# EAGLE design BAM_Reference_R2_1_1 (EAGLE 6.6.0)
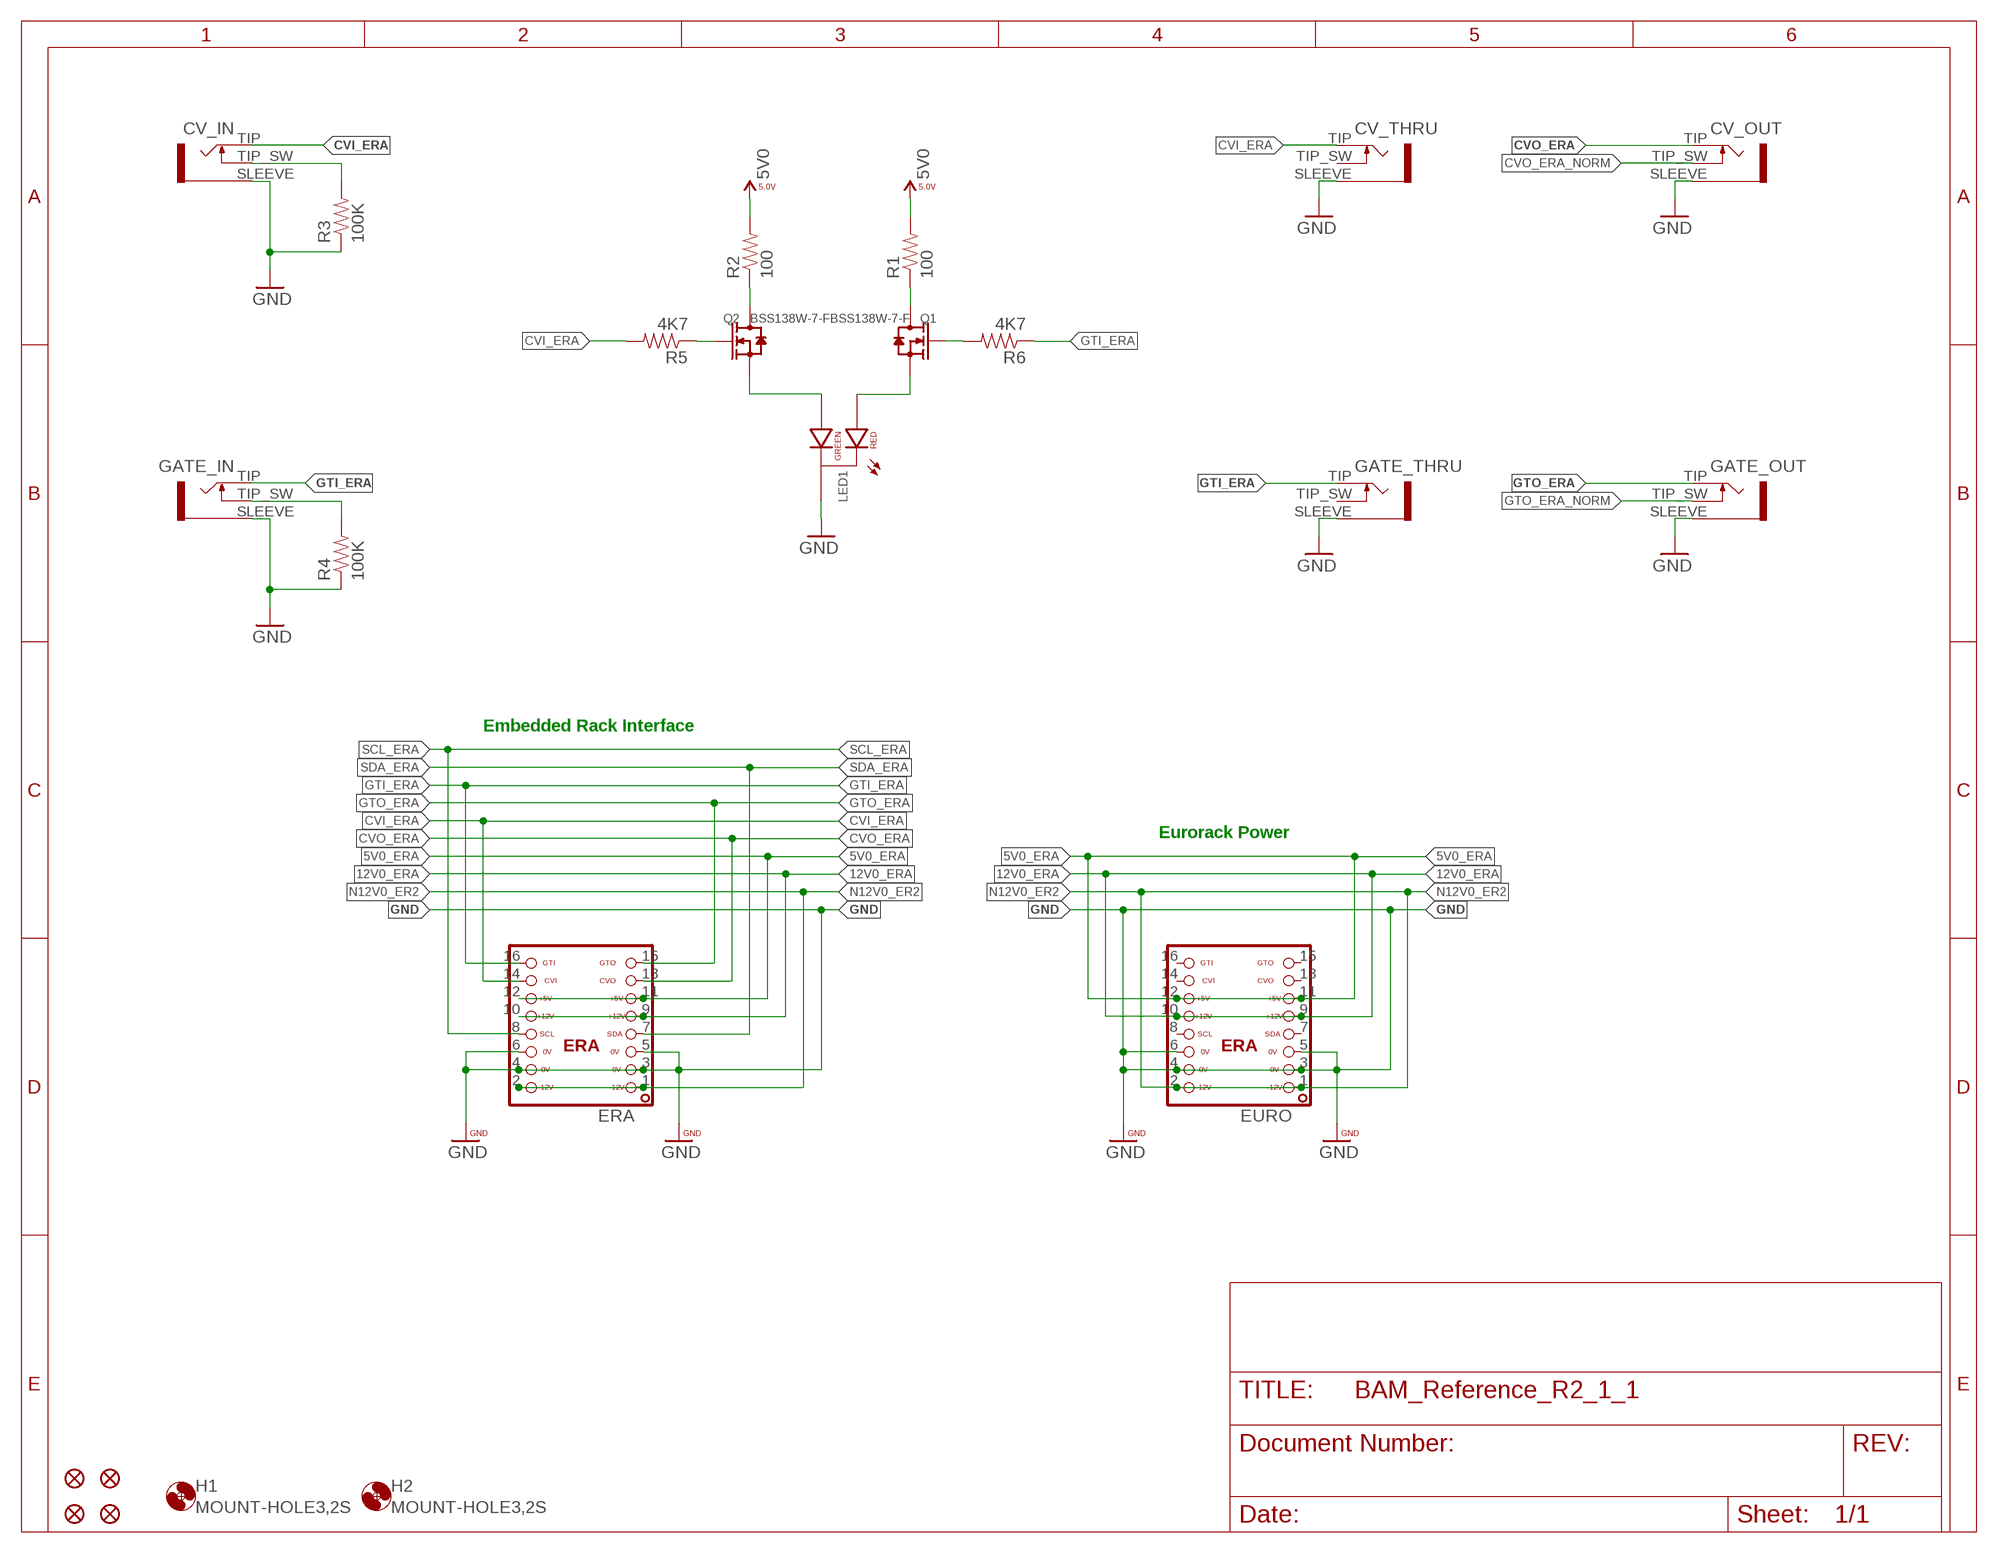
[diagram p0: schematic, sheet 1]

## Parts
CV_IN  JACK-3_5MM-MONO-SW-MJ_3502  [MJ-3502]
CV_OUT  JACK-3_5MM-MONO-SW-MJ_3502  [MJ-3502]
CV_THRU  JACK-3_5MM-MONO-SW-MJ_3502  [MJ-3502]
ERA  ERA-SHROUD  [ERA]
EURO  ERA-SHROUD  [ERA]
FID1  FIDUCIALUFIDUCIAL  [MICRO-FIDUCIAL]
FID2  FIDUCIALUFIDUCIAL  [MICRO-FIDUCIAL]
FID3  FIDUCIALUFIDUCIAL  [MICRO-FIDUCIAL]
FID4  FIDUCIALUFIDUCIAL  [MICRO-FIDUCIAL]
GATE_IN  JACK-3_5MM-MONO-SW-MJ_3502  [MJ-3502]
GATE_OUT  JACK-3_5MM-MONO-SW-MJ_3502  [MJ-3502]
GATE_THRU  JACK-3_5MM-MONO-SW-MJ_3502  [MJ-3502]
H1  MOUNT-HOLE3,2S  [3,2,SMALL]
H2  MOUNT-HOLE3,2S  [3,2,SMALL]
LED1  LED-RG-CC-PTH-G18500  [LED-RG-PANEL]
Q1  BSS138W-7-F  SMD-MOSFET-N-CH-50V-200MA-BSS138W-7-F(SOT-23)  [SOT-23]
Q2  BSS138W-7-F  SMD-MOSFET-N-CH-50V-200MA-BSS138W-7-F(SOT-23)  [SOT-23]
R1  100  RESISTOR0603  [0603-RES]
R2  100  RESISTOR0603  [0603-RES]
R3  100K  RESISTOR0603  [0603-RES]
R4  100K  RESISTOR0603  [0603-RES]
R5  4K7  RESISTOR0603  [0603-RES]
R6  4K7  RESISTOR0603  [0603-RES]

## Nets
5V0: R1.2 R2.2
5V0_ERA: ERA.11 ERA.12 EURO.11 EURO.12
12V0_ERA: ERA.9 ERA.10 EURO.9 EURO.10
CVI_ERA: CV_IN.TIP CV_THRU.TIP ERA.14 R5.2
CVO_ERA: CV_OUT.TIP ERA.13
CVO_ERA_NORM: CV_OUT.TIP_SW
GND: CV_IN.SLEEVE CV_OUT.SLEEVE CV_THRU.SLEEVE ERA.3 ERA.4 ERA.5 ERA.6 EURO.3 EURO.4 EURO.5 EURO.6 GATE_IN.SLEEVE GATE_OUT.SLEEVE GATE_THRU.SLEEVE LED1.CC(CATHODE) R3.1 R4.1
GTI_ERA: ERA.16 GATE_IN.TIP GATE_THRU.TIP R6.1
GTO_ERA: ERA.15 GATE_OUT.TIP
GTO_ERA_NORM: GATE_OUT.TIP_SW
N12V0_ER2: ERA.1 ERA.2 EURO.1 EURO.2
N$1: LED1.GREEN(GREEN_CATHODE) Q2.2(S)
N$2: LED1.RED(RED_CATHODE) Q1.2(S)
N$3: Q2.3(D) R2.1
N$4: Q1.3(D) R1.1
N$5: Q2.1(G) R5.1
N$6: Q1.1(G) R6.2
N$7: CV_IN.TIP_SW R3.2
N$8: GATE_IN.TIP_SW R4.2
SCL_ERA: ERA.8
SDA_ERA: ERA.7
Unconnected: CV_THRU.TIP_SW EURO.7 EURO.8 EURO.13 EURO.14 EURO.15 EURO.16 GATE_THRU.TIP_SW

## Notes on the sheet
- Embedded Rack Interface
- Eurorack Power

## Library data of the parts
CV_IN GATE_IN = oXo_Connectors:JACK-3_5MM-MONO-SW: Jack, 3.5mm, RIght Angle, Though-Hole
CV_OUT CV_THRU GATE_OUT GATE_THRU = halcyonmod_Connectors:JACK-3_5MM-MONO-SW: Jack, 3.5mm, RIght Angle, Though-Hole
ERA EURO = ERA:ERA: EuroRack2 - Backplane Connector
FID1-FID4 = TSOC-ESP8266-BASE:FIDUCIAL: Fiducial Alignment Points Various fiducial points for machine vision alignment.
H1 H2 = oXo_Hardware:MOUNT-HOLE: MOUNTING HOLE with drill center marker
LED1 = halcyonmod_Optoelectronics:LED-RG-CC-PTH: LED Red/Green Common Cathode Pin Through Hole
Q1 Q2 = Seeed-Transistor-2016:SMD-MOSFET-N-CH-50V-200MA-BSS138W-7-F(SOT-23): 305030000; MPN: BSS138W-7-F
R1-R6 = halcyonmod_Passives:RESISTOR: Resistor Basic schematic elements and footprints for 0603, 1206, and PTH resistors.

## Net classes
1 power: width 0.254 mm, drill 0.356 mm, clearance 0.178 mm

## Board
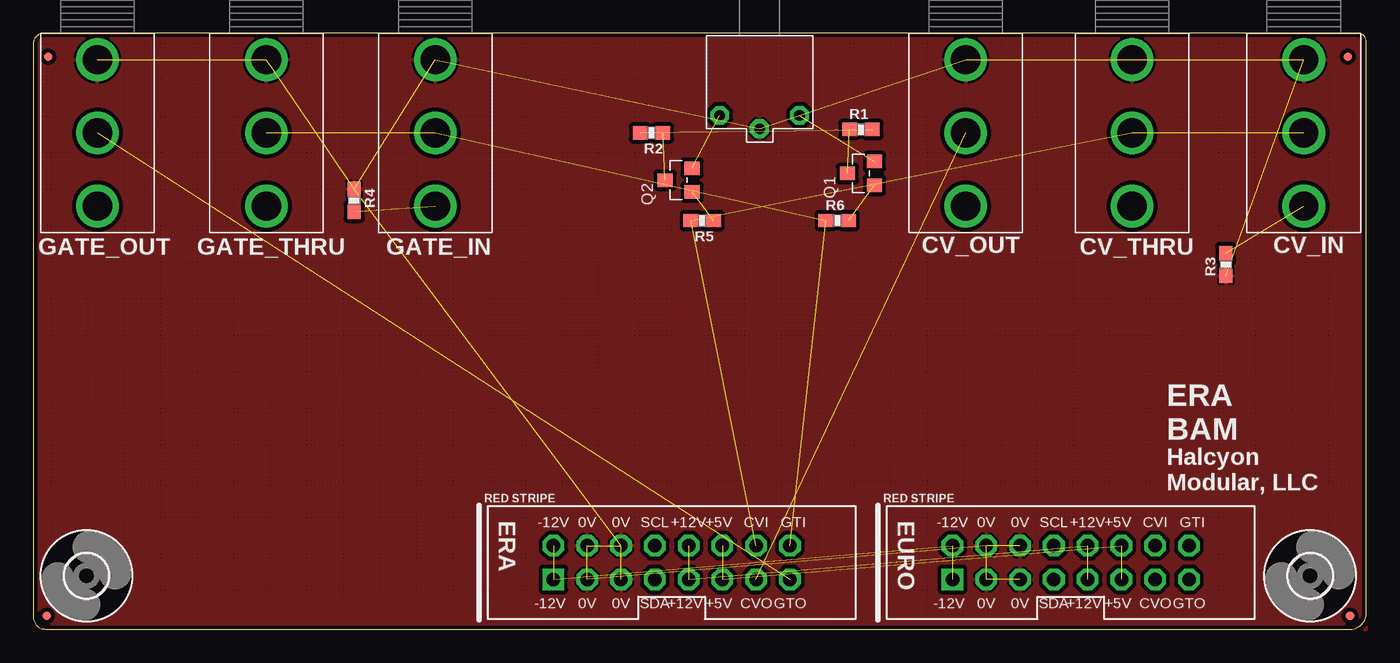
[diagram p1: board, top side]
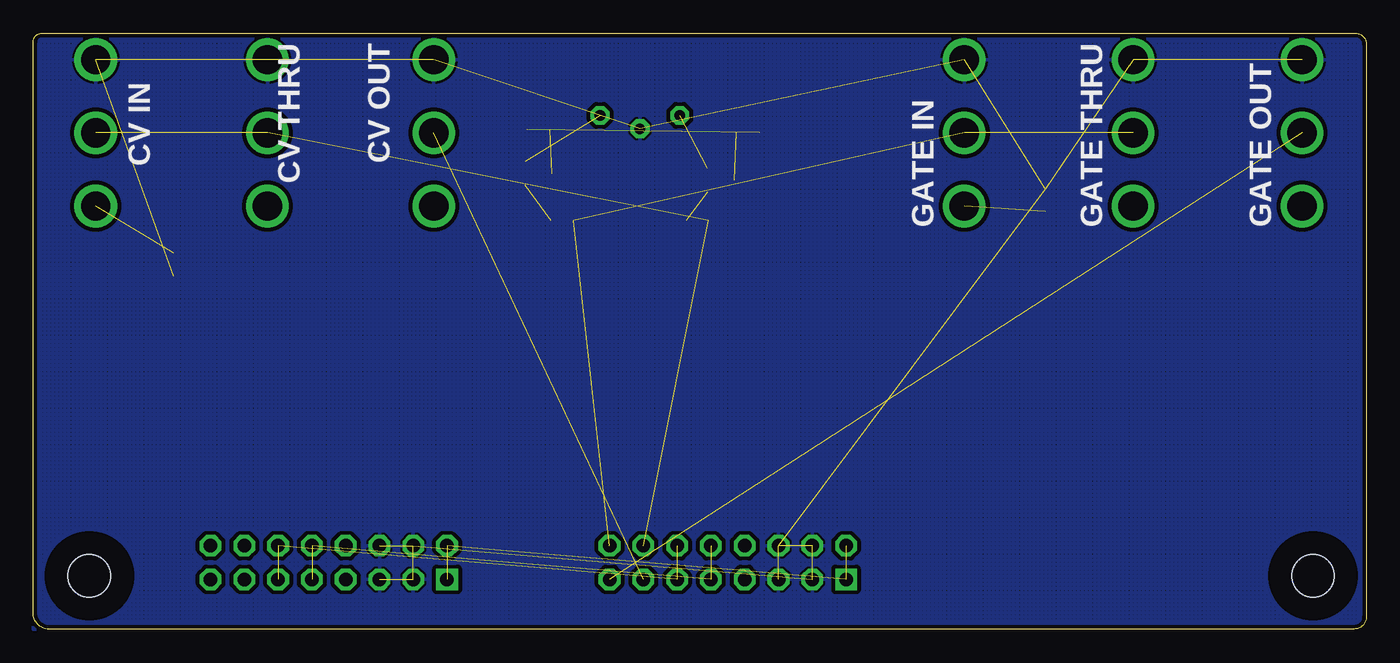
[diagram p2: board, bottom side, seen from below]

Size 100.22 x 44.84 mm. Coordinates in mm from the lower left corner, seen from the top.
Outline: 0.9,0.03 98.72,0.03 arc90 100.22,1.02 100.22,44.2 arc90 99.58,44.84 0.81,44.84 arc90 0,44.03 0,0.92 arc90 0.9,0.03
Copper layers (1*16): Top 0.035mm / dielectric 1.5mm / Bottom 0.035mm
Design rules "PatternAgents_7mil": minimum track width 7mil, minimum drill 14mil, track to track 7mil, track to pad 7mil, pad to pad 7mil, via to via 7mil, smd to smd 7mil, copper to edge 7mil, drill to drill 7mil, minimum pad ring 12mil, minimum via ring 10mil, stop-mask expansion 4mil, vias tented up to drill 25mil, thermal gap 7mil

### Footprints (pad centres in the part's own frame; a part is rotated, then mirrored left to right if it is on the bottom)
MJ-3502 = drill 2.2: SLEEVE -5.5,0; TIP 0,0; TIP_SW 5.5,0
ERA = drill 1.016 square: 1 -8.89,-1.27 | drill 1.016 octagon: 2 -8.89,1.27; 3 -6.35,-1.27; 4 -6.35,1.27; 5 -3.81,-1.27; 6 -3.81,1.27; 7 -1.27,-1.27; 8 -1.27,1.27; 9 1.27,-1.27; 10 1.27,1.27; 11 3.81,-1.27; 12 3.81,1.27; 13 6.35,-1.27; 14 6.35,1.27; 15 8.89,-1.27; 16 8.89,1.27
MICRO-FIDUCIAL = smd 0.635 x 0.635: 1 0,0
3,2,SMALL = hole 3.2: 0,0
LED-RG-PANEL = drill 0.8 octagon: CC 0,3.5; GREEN 3,2.5; RED -3,2.5
SOT-23 = smd 1.016 x 1.143: 1 -0.889,-1.016; 2 0.889,-1.016; 3 0,1.016
0603-RES = smd 1.1 x 1: 1 -0.85,0; 2 0.85,0

### Placement (x,y rotation side)
CV_IN  95.52,37.35 270 top
CV_OUT  70.1,37.35 270 top
CV_THRU  82.61,37.35 270 top
ERA  48,5.03 0 top
EURO  78,5.03 0 top
FID1  1.14,43.06 0 top
FID2  98.82,43.06 0 top
FID3  1,1.03 0 top
FID4  99,1.03 90 top
GATE_IN  30.23,37.35 270 top
GATE_OUT  4.83,37.35 270 top
GATE_THRU  17.53,37.35 270 top
H1  4,4.03 0 top
H2  96,4.03 0 top
LED1  54.61,41.16 180 top
Q1  62.23,34.3 90 top
Q2  48.51,33.79 90 top
R1  62.23,37.6 0 top
R2  46.48,37.35 180 top
R3  89.66,27.44 90 top
R4  24.13,32.27 270 top
R5  50.29,30.74 180 top
R6  60.45,30.74 0 top

### Tracks (layer width: path | path; a pad name or v marks a point on that pad's centre or on a via)
5V0  (1 unrouted)
5V0_ERA  (3 unrouted)
12V0_ERA  (3 unrouted)
CVI_ERA  (3 unrouted)
CVO_ERA  (1 unrouted)
GND  (16 unrouted)
  pour Top (isolate 0.305, hatched): 0,0.03 0,44.84 100.22,44.84 100.22,0.03
  pour Bottom (isolate 0.305, hatched): 0,0.03 0,44.84 100.22,44.84 100.22,0.03
GTI_ERA  (3 unrouted)
GTO_ERA  (1 unrouted)
N12V0_ER2  (3 unrouted)
N$1  (1 unrouted)
N$2  (1 unrouted)
N$3  (1 unrouted)
N$4  (1 unrouted)
N$5  (1 unrouted)
N$6  (1 unrouted)
N$7  (1 unrouted)
N$8  (1 unrouted)

### Text on the board
tPlace: ERA | BAM | Halcyon / Modular, LLC
bPlace: CV OUT | CV IN | CV THRU | GATE OUT | GATE THRU | GATE IN